# EAGLE board TAMDL_V2 (EAGLE 7.3.0)
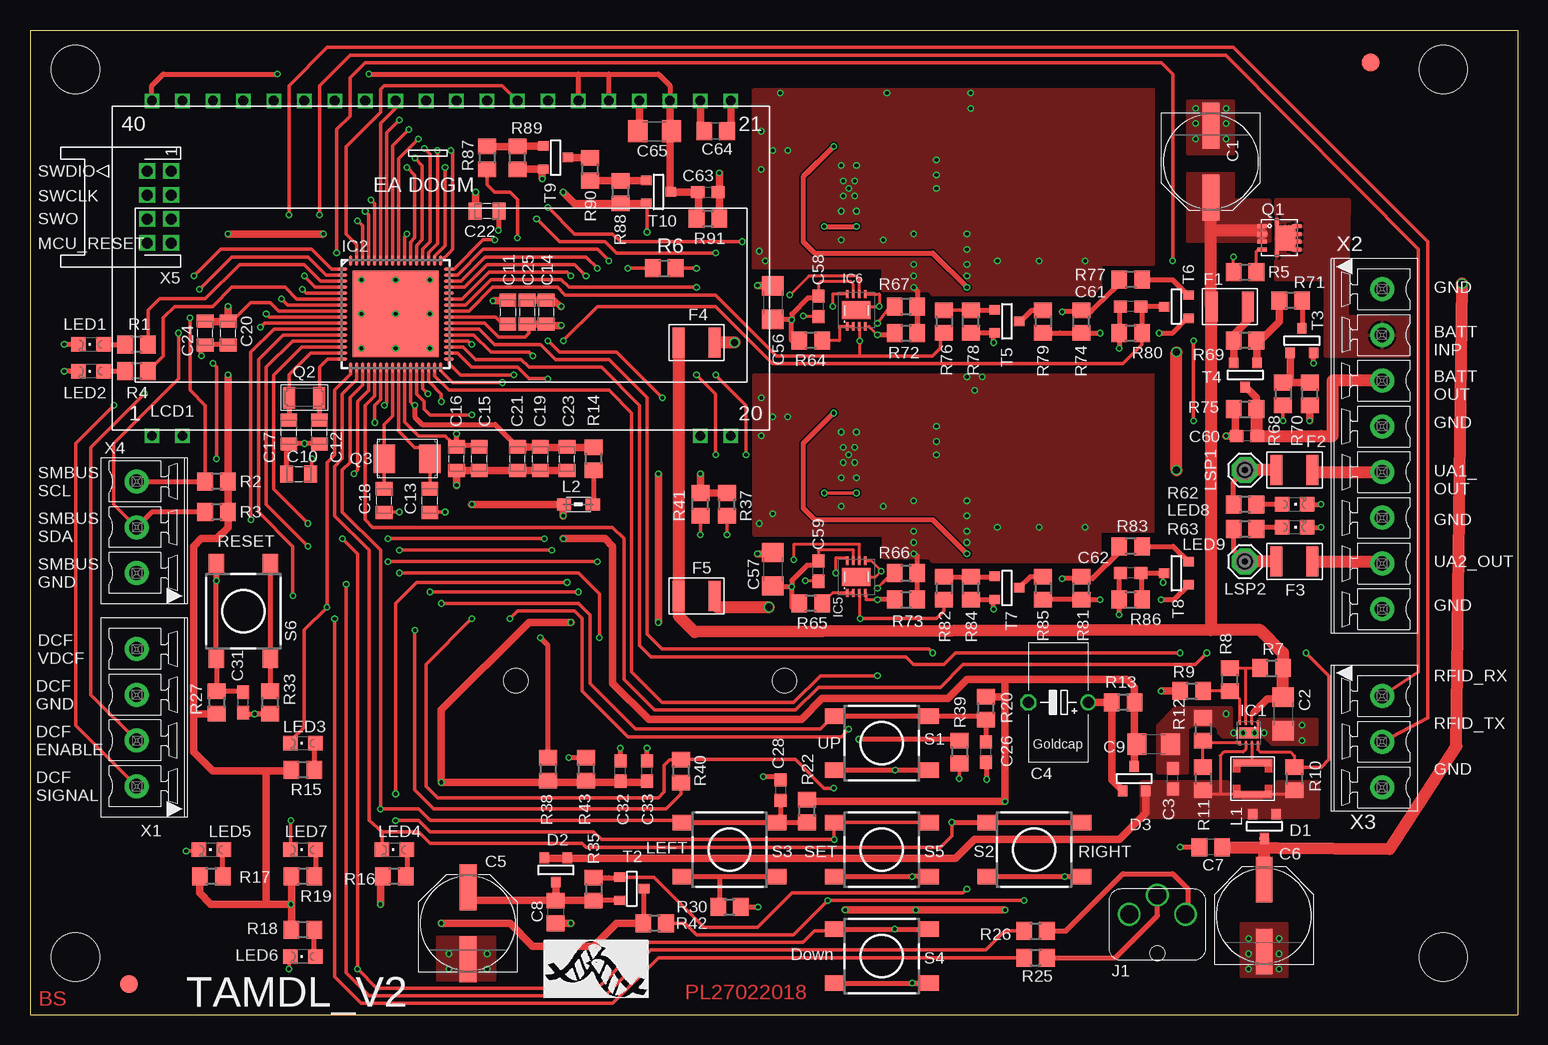
[diagram p6: board, top side]
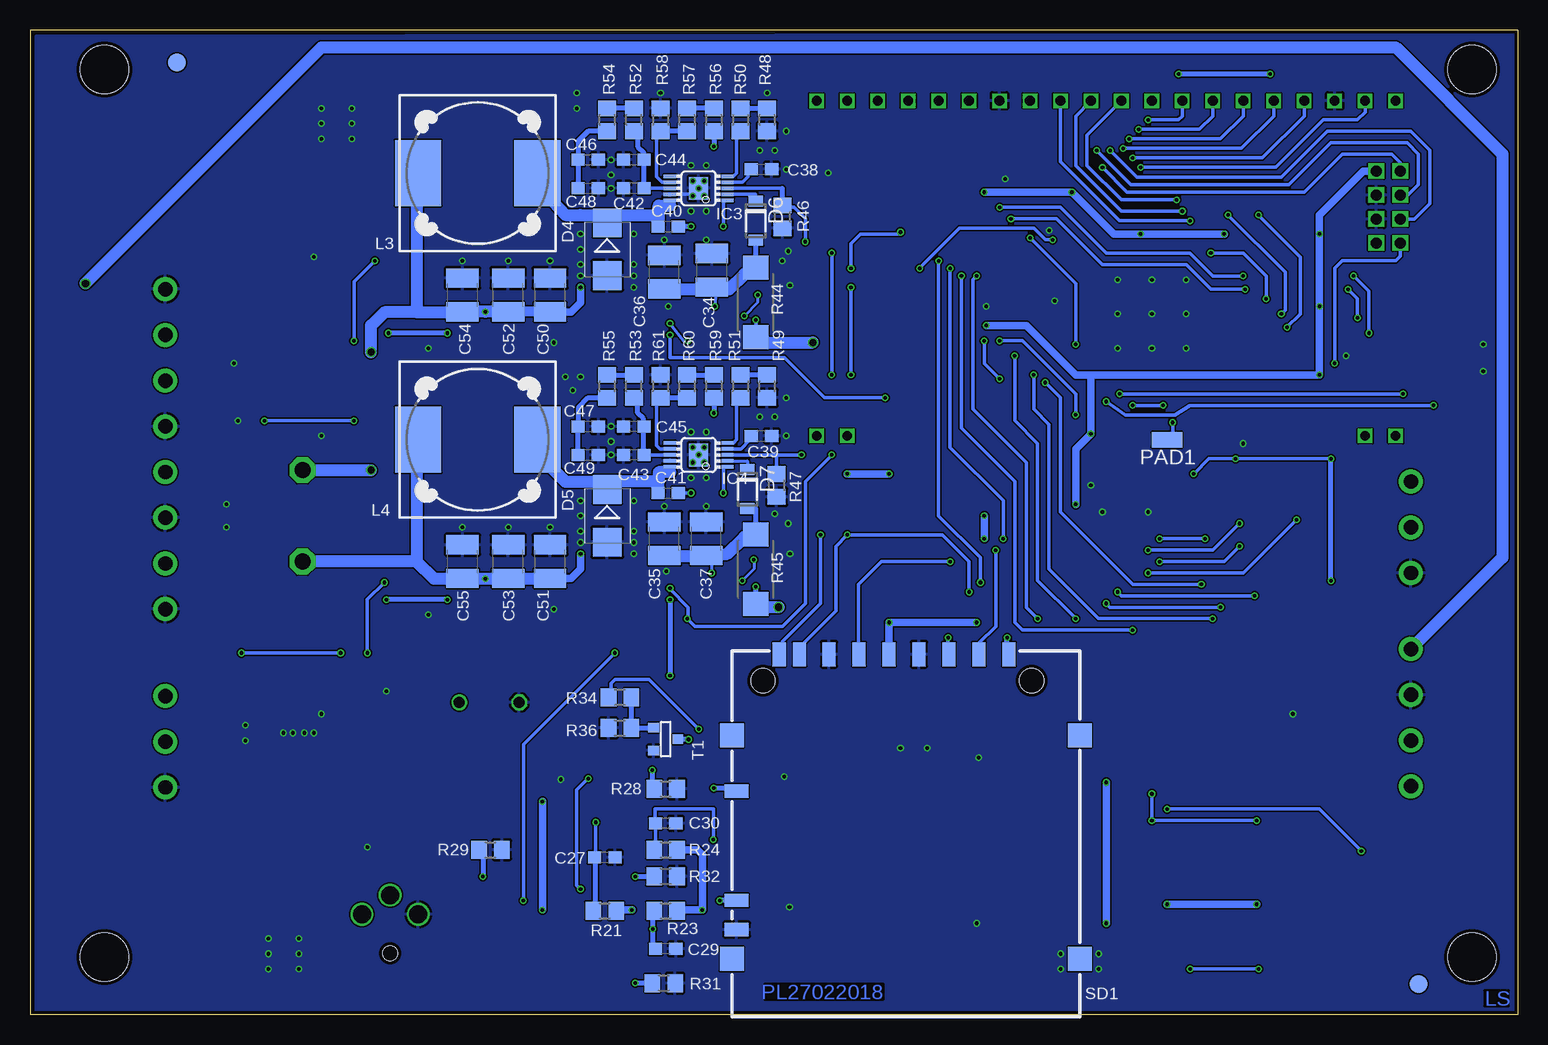
[diagram p7: board, bottom side, seen from below]

Size 124 x 82.1 mm. Coordinates in mm from the lower left corner, seen from the top.
Outline: 0,82.1 0,0 124,0 124,82.1 0,82.1
Copper layers (1*16): Top 0.035mm / dielectric 1.5mm / Bottom 0.035mm
Design rules "PCB-POOL HighSpec *": minimum track width 0.125mm, minimum drill 0.2mm, track to track 0.125mm, track to pad 0.125mm, pad to pad 0.125mm, via to via 0.125mm, smd to smd 0mil, copper to edge 0.3mm, drill to drill 0.2mm, minimum pad ring 0.2mm, minimum via ring 0.125mm, stop-mask expansion 0.075mm, vias tented up to drill 0mil, thermal gap 0.2mm
Net classes: 1 GND: width 0.2 mm; 2 VCC: width 0.25 mm
Holes 4 mm at 3.8,4.8 3.8,78.8 117.8,78.8 117.8,4.8

## Footprints (pad centres in the part's own frame; a part is rotated, then mirrored left to right if it is on the bottom)
PANASONIC_E = smd 3.8 x 1.4: + 3,0; - -3,0
C1206 = smd 1.6 x 1.8: 1 -1.4,0; 2 1.4,0
C0603 = smd 1.1 x 1: 1 -0.85,0; 2 0.85,0
GOLDCAPSPK-V = drill 0.9: + -2.5,0 | drill 0.9 octagon: - 2.5,0
C0805 = smd 1.3 x 1.5: 1 -0.95,0; 2 0.95,0
0805 = smd 1.092 x 1.397: 1 -0.991,0; 2 0.991,0
C1210 = smd 1.6 x 2.7: 1 -1.4,0; 2 1.4,0
SOT-23$1 = smd 0.787 x 0.889: 1 0.025,-1.016; 2 -0.94,1.016; 3 0.991,1.016
SMB = smd 2.4 x 2.4: A 2.2,0; C -2.2,0
SOD123FL = smd 0.91 x 1.22: A 1.625,0; C -1.625,0
PFUF_1210POLY = smd 1 x 2.5: P$1 -1.5,0; P$2 1.5,0
DSG_PWSO-N8_EXP = smd 0.2 x 0.4: 1 -0.75,-0.85; 2 -0.25,-0.85; 3 0.25,-0.85; 4 0.75,-0.85; 5 0.75,0.85; 6 0.25,0.85; 7 -0.25,0.85; 8 -0.75,0.85 | smd 1.6 x 0.9: EXP 0,0
QFN64 = smd 0.85 x 0.3: 1 -4.45,3.75; 2 -4.45,3.25; 3 -4.45,2.75; 4 -4.45,2.25; 5 -4.45,1.75; 6 -4.45,1.25; 7 -4.45,0.75; 8 -4.45,0.25; 9 -4.45,-0.25; 10 -4.45,-0.75; 11 -4.45,-1.25; 12 -4.45,-1.75; 13 -4.45,-2.25; 14 -4.45,-2.75; 15 -4.45,-3.25; 16 -4.45,-3.75; 33 4.45,-3.75; 34 4.45,-3.25; 35 4.45,-2.75; 36 4.45,-2.25; 37 4.45,-1.75; 38 4.45,-1.25; 39 4.45,-0.75; 40 4.45,-0.25; 41 4.45,0.25; 42 4.45,0.75; 43 4.45,1.25; 44 4.45,1.75; 45 4.45,2.25; 46 4.45,2.75; 47 4.45,3.25; 48 4.45,3.75 | smd 0.3 x 0.85: 17 -3.75,-4.45; 18 -3.25,-4.45; 19 -2.75,-4.45; 20 -2.25,-4.45; 21 -1.75,-4.45; 22 -1.25,-4.45; 23 -0.75,-4.45; 24 -0.25,-4.45; 25 0.25,-4.45; 26 0.75,-4.45; 27 1.25,-4.45; 28 1.75,-4.45; 29 2.25,-4.45; 30 2.75,-4.45; 31 3.25,-4.45; 32 3.75,-4.45; 49 3.75,4.45; 50 3.25,4.45; 51 2.75,4.45; 52 2.25,4.45; 53 1.75,4.45; 54 1.25,4.45; 55 0.75,4.45; 56 0.25,4.45; 57 -0.25,4.45; 58 -0.75,4.45; 59 -1.25,4.45; 60 -1.75,4.45; 61 -2.25,4.45; 62 -2.75,4.45; 63 -3.25,4.45; 64 -3.75,4.45 | smd 7.2 x 7.2: 65 0,0
S-PDSO-G10 = smd 0.3 x 1.02: 1 -1,-2.4; 2 -0.5,-2.4; 3 0,-2.4; 4 0.5,-2.4; 5 1,-2.4; 6 1,2.4; 7 0.5,2.4; 8 0,2.4; 9 -0.5,2.4; 10 -1,2.4 | smd 1.9 x 1.6: EXP 0,0
DFN8-LEAD = smd 0.2 x 0.7: 1 -0.75,-1.35; 2 -0.25,-1.35; 3 0.25,-1.35; 4 0.75,-1.35; 5 0.75,1.35; 6 0.25,1.35; 7 -0.25,1.35; 8 -0.75,1.35 | smd 2.38 x 1.5: EXP 0,0
LUMBERG1502_01 = drill 1.5: P$1 -2.35,0.75; P$2 0,2.35; P$3 2.35,0.75 | hole 1.2: 0,-2.5
LPS3008 = smd 0.63 x 3.3: 1 -1.335,0; 2 1.335,0
0805' = smd 1.2 x 1: 1 -1.2,0; 2 1.2,0
DR127 = smd 3.85 x 5.5: 1 -4.975,0; 2 4.975,0
EA_DOGM = drill 0.813 square: 1 0,0; 2 2.54,0; 19 45.72,0; 20 48.26,0; 21 48.26,27.94; 22 45.72,27.94; 23 43.18,27.94; 24 40.64,27.94; 25 38.1,27.94; 26 35.56,27.94; 27 33.02,27.94; 28 30.48,27.94; 29 27.94,27.94; 30 25.4,27.94; 31 22.86,27.94; 32 20.32,27.94; 33 17.78,27.94; 34 15.24,27.94; 35 12.7,27.94; 36 10.16,27.94; 37 7.62,27.94; 38 5.08,27.94; 39 2.54,27.94; 40 0,27.94
CHIPLED_0805 = smd 1.2 x 1.2: A 0,-1.05; C 0,1.05
SE13 = drill 1.321 pad 2.159 octagon: MP 0,0
SMD1,27-2,54 = smd 1.27 x 2.54: 1 0,0
ROUND2_1.5MM = smd 1.5 x 1.5: FID 0,0
TRANSISTOR-FET_1212-8S = smd 0.8 x 0.34: 1 -1.435,0.97; 2 -1.435,0.325; 3 -1.435,-0.325; 4 -1.435,-0.975; 5 1.435,-0.975; 6 1.435,-0.325; 7 1.435,0.325; 8 1.435,0.975 | smd 0.3 x 0.8: 9 -0.2,-1.225; 10 -0.2,1.25 | smd 1.7 x 2.1: 11 0.5,-0.015
CRYSTAL2P3.2X1.5 = smd 1 x 1.8: 1 -1.25,0; 2 1.25,0
CRYSTAL2P5.0X3.2 = smd 1.8 x 2.4: 1 -1.9,0; 2 1.9,0
R0805 = smd 1.3 x 1.5: 1 -0.95,0; 2 0.95,0
R2512W = smd 2 x 2.1: 1 -2.896,0; 2 2.896,0
DTSM-6 = smd 1.55 x 1.3: 1 -3.975,2.25; 2 3.975,2.25; 3 -3.975,-2.25; 4 3.975,-2.25
DM1AA-SF-PEJ = smd 1.1 x 2: 1 6.1,14.95; 2 3.6,14.95; 3 1.1,14.95; 4 -1.4,14.95; 5 -3.9,14.95; 6 -6.4,14.95; 7 -8.85,14.95; 8 -10.55,14.95; 9 8.6,14.95 | smd 2 x 1.1: CDS -14.1,3.55; COM -14.1,-8; WPS -14.1,-5.566 | smd 2 x 2: G1 -14.5,8.2; G2 -14.5,-10.45; G3 14.5,-10.45; G4 14.5,8.2 | hole 2: -11.9,12.75; 10.5,12.75
ZETEX_SOT-23 = smd 0.787 x 0.889: 1 0.025,-1.016; 2 -0.94,1.016; 3 0.991,1.016
1803439 = drill 1.2 pad 2: 1 -3.81,0.635; 2 0,0.635; 3 3.81,0.635
1803484 = drill 1.2 pad 2: 1 -13.335,-0.635; 2 -9.525,-0.635; 3 -5.715,-0.635; 4 -1.905,-0.635; 5 1.905,-0.635; 6 5.715,-0.635; 7 9.525,-0.635; 8 13.335,-0.635
1803442 = drill 1.2 pad 2: 1 -5.715,0.635; 2 -1.905,0.635; 3 1.905,0.635; 4 5.715,0.635
DP11_8DP-2DS = drill 0.9 square: 1 3,-9.2; 2 3,-7.2; 3 1,-9.2; 4 1,-7.2; 5 -1,-9.2; 6 -1,-7.2; 7 -3,-9.2; 8 -3,-7.2

## Placement (x,y rotation side)
C1  100µF/25V  [PANASONIC_E]  98.42,71.12 270 top
C2  10µF/25V  [C1206]  104.46,25.08 270 top
C3  22µF/10V  [C0603]  95.25,19.68 90 top
C4  EECS0HD 224;Panasonic  [GOLDCAPSPK-V]  85.72,26.04 180 top
C5  100µF/25V  [PANASONIC_E]  36.51,7.62 90 top
C6  100µF/25V  [PANASONIC_E]  102.87,8.26 90 top
C7  100nF/16V  [C0805]  98.42,13.97 180 top
C8  100nF/16V  [C0805]  43.81,8.57 270 top
C9  10µ/25V  [C1206]  93.66,22.54 180 top
C10  100n  [0805]  22.4,45.07 0 top
C11  1u  [0805]  39.83,58.58 270 top
C12  18p  [0805]  24.13,48.58 90 top
C13  12p  [0805]  33.34,42.86 90 top
C14  100n  [0805]  43.02,58.58 270 top
C15  100n  [0805]  37.47,46.35 90 top
C16  100n  [0805]  35.56,46.35 90 top
C17  18p  [0805]  21.59,48.58 90 top
C18  12p  [0805]  29.53,42.86 90 top
C19  10µ  [0805]  42.55,46.35 90 top
C20  100n  [0805]  16.51,56.83 90 top
C21  100n  [0805]  40.64,46.35 90 top
C22  100n  [0805]  38.1,66.99 180 top
C23  100n  [0805]  44.77,46.35 90 top
C24  100n  [0805]  14.61,56.83 90 top
C25  10µ  [0805]  41.43,58.58 270 top
C26  10nF  [C0603]  79.69,21.91 90 top
C27  10nF  [C0603]  76.09,13.11 180 bottom
C28  10nF  [C0603]  62.55,18.73 270 top
C29  10nF  [C0603]  71.01,5.49 180 bottom
C30  10nF  [C0603]  71.01,15.97 180 bottom
C31  10n  [C0603]  17.78,26.04 90 top
C32  100nF  [C0603]  49.21,20.32 90 top
C33  100nF  [C0603]  51.44,20.32 90 top
C34  4.7µF  [C1210]  67.15,62.07 90 bottom
C35  4.7µF  [C1210]  71.12,39.69 90 bottom
C36  n.b.  [C1210]  71.12,61.91 90 bottom
C37  n.b.  [C1210]  67.63,39.69 90 bottom
C38  10nF  [C0603]  63.02,70.49 0 bottom
C39  10nF  [C0603]  63.02,48.26 0 bottom
C40  100nF  [C0603]  70.8,65.72 0 bottom
C41  100nF  [C0603]  70.8,43.5 0 bottom
C42  n.b.  [C0603]  73.66,68.9 180 bottom
C43  n.b.  [C0603]  73.66,46.67 180 bottom
C44  4.3nF  [C0603]  73.66,71.28 180 bottom
C45  4.3nF  [C0603]  73.66,49.05 180 bottom
C46  24pF  [C0603]  77.47,71.28 0 bottom
C47  24pF  [C0603]  77.47,49.05 0 bottom
C48  n.b.  [C0603]  77.47,68.9 0 bottom
C49  n.b  [C0603]  77.47,46.67 0 bottom
C50  22µF  [C1210]  80.65,60.01 90 bottom
C51  22µF  [C1210]  80.65,37.78 90 bottom
C52  22µF  [C1210]  84.14,60.01 90 bottom
C53  22µF  [C1210]  84.14,37.78 90 bottom
C54  n.b.  [C1210]  87.95,60.01 90 bottom
C55  n.b.  [C1210]  87.95,37.78 90 bottom
C56  10µF  [C1206]  61.91,59.37 270 top
C57  10µF  [C1206]  61.91,37.15 270 top
C58  100nF  [C0603]  65.72,59.06 90 top
C59  100nF  [C0603]  65.72,36.99 90 top
C60  100nF  [C0603]  101.44,48.26 180 top
C61  1nF  [C0603]  91.76,59.05 180 top
C62  1nF  [C0603]  91.76,36.83 180 top
C63  100nF  [C0603]  56.52,68.58 0 top
C64  470n  [C0805]  57.15,73.66 180 top
C65  100n  [C1206]  52.07,73.66 0 top
D1  BAT54C  [SOT-23$1]  102.87,15.72 0 top
D2  BAT54C  [SOT-23$1]  43.81,12.06 0 top
D3  BAT54C  [SOT-23$1]  92.08,19.68 180 top
D4  B360B  [SMB]  75.88,63.82 270 bottom
D5  B360B  [SMB]  75.88,41.59 270 bottom
D6  MBR2H200SFT1G  [SOD123FL]  63.5,66.2 270 bottom
D7  MBR2H200SFT1G  [SOD123FL]  64.2,43.81 270 bottom
F1  MF-USMF110  [PFUF_1210POLY]  100.01,59.05 180 top
F2  MF-USMF110  [PFUF_1210POLY]  105.41,45.4 0 top
F3  MF-USMF110  [PFUF_1210POLY]  105.41,37.78 0 top
F4  MF-USMF150  [PFUF_1210POLY]  55.56,56.04 0 top
F5  MF-USMF150  [PFUF_1210POLY]  55.56,34.92 0 top
IC1  TPS62125  [DSG_PWSO-N8_EXP]  101.6,23.5 180 top
IC2  EFM32G230F128  [QFN64]  30.48,58.42 0 top
IC3  TPS54240DGQR  [S-PDSO-G10]  68.26,68.9 90 bottom
IC4  TPS54240DGQR  [S-PDSO-G10]  68.26,46.67 90 bottom
IC5  LTC6102IDD-1  [DFN8-LEAD]  68.89,36.51 0 top
IC6  LTC6102IDD-1  [DFN8-LEAD]  68.89,58.73 0 top
J1  LUMBERG1502_01  [LUMBERG1502_01]  93.98,7.62 0 top
L1  LPS3008/22µH  [LPS3008]  101.92,19.68 270 top
L2  BLM21B102S  [0805']  45.72,42.55 0 top
L3  PIS4728  [DR127]  86.68,70.17 180 bottom
L4  PIS4728  [DR127]  86.68,47.94 180 bottom
LCD1  Buchsenleisten(Conrad 741360) (n.b.)EA_DOGM162L_A  [EA_DOGM]  10.16,48.26 0 top
LED1  SML-H12U8TT86  [CHIPLED_0805]  5.08,55.88 90 top
LED2  SML-H12Y8TT86  [CHIPLED_0805]  5.08,53.66 90 top
LED3  SML-H12Y8TT86  [CHIPLED_0805]  22.75,22.64 90 top
LED4  SML-H12Y8TT86  [CHIPLED_0805]  30.37,13.75 90 top
LED5  SML-H12Y8TT86  [CHIPLED_0805]  15.13,13.75 90 top
LED6  SML-H12Y8TT86  [CHIPLED_0805]  22.75,4.86 90 top
LED7  SML-H12U8TT86  [CHIPLED_0805]  22.75,13.75 90 top
LED8  (n.b.)  [CHIPLED_0805]  105.41,42.55 270 top
LED9  (n.b.)  [CHIPLED_0805]  105.41,40.64 270 top
LSP1  (n.b.)SE13  [SE13]  101.28,45.4 0 top
LSP2  (n.b.)SE13  [SE13]  101.28,37.78 0 top
PAD1  (n.b.)  [SMD1,27-2,54]  29.21,47.94 90 bottom
PASS1  ROUND_1MM1.5  [ROUND2_1.5MM]  8.26,2.54 0 top
PASS2  ROUND_1MM1.5  [ROUND2_1.5MM]  8.26,2.54 0 bottom
PASS3  ROUND_1MM1.5  [ROUND2_1.5MM]  111.76,79.38 0 top
PASS4  ROUND_1MM1.5  [ROUND2_1.5MM]  111.76,79.38 0 bottom
Q1  SI7121DN  [TRANSISTOR-FET_1212-8S]  104.14,64.77 0 top
Q2  CM7V, 32768Hz/12.5pF  [CRYSTAL2P3.2X1.5]  22.86,51.44 180 top
Q3  NX5032GA/32MHz/8pF  [CRYSTAL2P5.0X3.2]  31.43,46.35 180 top
R1  1K2  [R0805]  8.89,55.88 180 top
R2  1k  [R0805]  15.56,44.45 180 top
R3  1k  [R0805]  15.56,41.91 180 top
R4  1K2  [R0805]  8.89,53.66 180 top
R5  100k  [R0805]  101.28,61.91 0 top
R6  100K  [R0805]  52.86,62.23 0 top
R7  1M47  [R0805]  103.5,28.89 0 top
R8  200K  [R0805]  100.01,27.94 90 top
R9  30K9  [R0805]  96.84,26.99 0 top
R10  100K  [R0805]  105.41,19.68 90 top
R11  2M  [R0805]  97.79,19.68 270 top
R12  560K  [R0805]  97.79,23.81 270 top
R13  100  [R0805]  91.12,26.04 180 top
R14  1  [R0805]  46.99,46.35 90 top
R15  1K  [R0805]  22.75,20.42 180 top
R16  1K  [R0805]  30.37,11.53 180 top
R17  1K  [R0805]  15.13,11.53 180 top
R18  1K  [R0805]  22.75,7.08 180 top
R19  1K  [R0805]  22.75,11.53 180 top
R20  100K  [R0805]  79.69,25.56 90 top
R21  100K  [R0805]  76.09,8.67 0 bottom
R22  100K  [R0805]  64.77,16.99 90 top
R23  100K  [R0805]  71.01,8.67 0 bottom
R24  100K  [R0805]  71.01,13.75 0 bottom
R25  10K  [R0805]  83.82,4.76 0 top
R26  10K  [R0805]  83.82,6.99 0 top
R27  100K  [R0805]  15.56,26.04 270 top
R28  100  [R0805]  71.01,18.83 0 bottom
R29  100  [R0805]  85.62,13.75 0 bottom
R30  100  [R0805]  58.31,8.99 0 top
R31  100  [R0805]  71.17,2.64 0 bottom
R32  100  [R0805]  71.01,11.53 0 bottom
R33  100  [R0805]  20,26.04 270 top
R34  100  [R0805]  74.82,26.45 180 bottom
R35  100K  [R0805]  46.99,10.48 270 top
R36  100K  [R0805]  74.82,23.91 0 bottom
R37  10K  [R0805]  58.1,42.55 90 top
R38  10K  [R0805]  43.18,20.48 270 top
R39  100  [R0805]  77.47,21.91 270 top
R40  1K  [R0805]  54.29,20.3 90 top
R41  1K  [R0805]  55.88,42.55 90 top
R42  (n.b.)10K  [R0805]  52.07,7.62 180 top
R43  100K  [R0805]  46.35,20.48 270 top
R44  0.006  [R2512W]  63.5,59.37 90 bottom
R45  0.006  [R2512W]  63.5,37.15 90 bottom
R46  100K  [R0805]  61.28,66.52 90 bottom
R47  100K  [R0805]  61.75,44.13 90 bottom
R48  348K  [R0805]  62.55,74.61 90 bottom
R49  348K  [R0805]  62.55,52.39 90 bottom
R50  0R  [R0805]  64.77,74.61 270 bottom
R51  0R  [R0805]  64.77,52.39 270 bottom
R52  39K  [R0805]  73.66,74.61 90 bottom
R53  39K  [R0805]  73.66,52.39 90 bottom
R54  0R  [R0805]  75.88,74.61 90 bottom
R55  0R  [R0805]  75.88,52.39 90 bottom
R56  0R  [R0805]  66.99,74.61 270 bottom
R57  105K  [R0805]  69.22,74.61 90 bottom
R58  10k  [R0805]  71.44,74.61 270 bottom
R59  0R  [R0805]  66.99,52.39 270 bottom
R60  53K  [R0805]  69.22,52.39 90 bottom
R61  10K  [R0805]  71.44,52.39 270 bottom
R62  (n.b.)  [R0805]  101.28,42.55 180 top
R63  (n.b.)  [R0805]  101.28,40.48 180 top
R64  150  [R0805]  65.09,56.2 180 top
R65  150  [R0805]  65.09,34.29 180 top
R66  100K  [R0805]  73.02,36.83 0 top
R67  100K  [R0805]  73.02,59.06 0 top
R68  100  [R0805]  104.46,51.75 270 top
R69  100K  [R0805]  101.28,56.2 180 top
R70  100K  [R0805]  106.68,51.75 90 top
R71  100  [R0805]  105.09,59.53 180 top
R72  40K  [R0805]  73.02,56.83 0 top
R73  40K  [R0805]  73.02,34.61 0 top
R74  100K  [R0805]  87.63,57.78 90 top
R75  100K  [R0805]  101.28,50.48 0 top
R76  100  [R0805]  76.2,57.78 270 top
R77  300K  [R0805]  91.76,61.28 180 top
R78  100K  [R0805]  78.42,57.78 90 top
R79  100  [R0805]  84.45,57.79 270 top
R80  100K  [R0805]  91.76,56.83 0 top
R81  100K  [R0805]  87.63,35.56 90 top
R82  100  [R0805]  76.2,35.56 270 top
R83  300K  [R0805]  91.76,39.05 180 top
R84  100K  [R0805]  78.42,35.56 90 top
R85  100  [R0805]  84.45,35.56 270 top
R86  100K  [R0805]  91.76,34.61 0 top
R87  100  [R0805]  38.1,71.44 270 top
R88  100K  [R0805]  49.21,68.58 270 top
R89  100K  [R0805]  40.64,71.44 90 top
R90  100  [R0805]  46.67,70.48 270 top
R91  100K  [R0805]  56.52,66.36 180 top
S1  SWPB_B3S1000  [DTSM-6]  71.01,22.66 0 top
S2  SWPB_B3S1000  [DTSM-6]  83.71,13.77 0 top
S3  SWPB_B3S1000  [DTSM-6]  58.31,13.77 0 top
S4  SWPB_B3S1000  [DTSM-6]  71.01,4.88 0 top
S5  SWPB_B3S1000  [DTSM-6]  71.01,13.77 0 top
S6  SWPB_B3S1000  [DTSM-6]  17.78,33.66 90 top
SD1  DM1AA-SF-PEJ  [DM1AA-SF-PEJ]  51,15.1 0 bottom
T1  2N7002  [ZETEX_SOT-23]  71.01,22.96 90 bottom
T2  FDN358P  [ZETEX_SOT-23]  50.16,10.48 90 top
T3  2N7002  [ZETEX_SOT-23]  106.05,56.2 180 top
T4  FDN358P  [ZETEX_SOT-23]  101.28,53.34 0 top
T5  2N7002  [ZETEX_SOT-23]  81.44,57.78 90 top
T6  FDN358P  [ZETEX_SOT-23]  95.57,59.05 270 top
T7  2N7002  [ZETEX_SOT-23]  81.44,35.56 90 top
T8  FDN358P  [ZETEX_SOT-23]  95.57,36.83 270 top
T9  2N7002  [ZETEX_SOT-23]  43.81,71.44 90 top
T10  FDN358P  [ZETEX_SOT-23]  52.39,68.58 90 top
U$1  [MPIO-ICON]  42.86,1.43 0 top
X1  1803439  [1803439]  9.53,40.64 90 top
X2  1803484  [1803484]  113.35,47.15 270 top
X3  1803439  [1803439]  112.08,22.77 270 top
X4  1803442  [1803442]  9.53,24.77 90 top
X5  DF11_8DP_2DS  [DP11_8DP-2DS]  2.57,67.34 90 top

## Tracks (layer width: path | path; a pad name or v marks a point on that pad's centre or on a via)
1
  Top 0.254: IC1.6 101.35,22.13 101.12,21.91 99.54,21.91 99.22,21.59 99.22,18.41 | 99.22,18.41 101.85,18.41 L1.2 102.96,18.35 103.03,18.41 105.09,18.41 R10.1 | R11.2 97.79,18.41 99.22,18.41
  Top 0.61: D3.2 93.03,18.66 93.03,16.83 90.81,14.61 78.74,14.61 77.15,13.02 44.77,13.02 | 44.77,13.02 42.94,13.02 D2.2 | D2.3 44.81,13.06 44.77,13.02
  pour Top (no thermals): 92.71,19.37 99.85,19.37 99.85,18.41 103.98,18.41 103.98,19.37 107.31,19.37 107.31,16.51 92.71,16.51
AVDD  (via drill 0.3)
  Top 0.305: IC2.23 29.73,51 v29.53,50.8 | v32.07,50.8 31.73,51.1 IC2.27
  Top 0.406: v32.07,50.8 32.07,49.85 32.7,49.21 38.77,49.21 C21.2 | C19.2 C23.2
  Top 0.61: R14.2 42.59,47.3 C19.2 C21.2
  Bottom 0.305: v29.53,50.8 v32.07,50.8
BAT+
  pour Top: 107.95,54.93 114.94,54.93 114.94,58.1 109.86,58.26 110.01,67.94 103.82,67.94 103.82,61.28 107.95,61.28
BATT_INPUT
  Top 0.254: IC1.2 101.85,25.17 102.08,25.24
  Top 0.61: 102.08,25.24 103.16,26.32 104.46,26.32 C2.1
  Top 1.016: C2.1 R7.2 | 98.42,32.07 102.55,32.07 104.46,30.16 R7.2 | 98.42,65.41 102.39,65.41 Q1.2 | 98.42,59.14 98.42,32.07 | 98.42,32.07 55.4,31.91 54.06,33.25 F5.P$1 F4.P$1 | R7.2 | F1.P$2 98.42,59.14 | 98.42,59.14 98.42,65.41 | 98.42,65.41 C1.+
  pour Top (no thermals): 103.35,64.45 96.52,64.45 96.52,70.17 100.33,70.17 100.33,67.94 103.35,67.94
BATT_OUTPUT
  Top 0.61: T4.1 101.35,52.32 102.23,51.44 R75.2
  Top 1.016: C60.1 107.63,48.26 | C60.1 102.29,50.42 R75.2 | C60.1 108.58,48.26 108.58,52.7 108.58,52.86 X2.3
BATT_UE
  Top 0.61: F1.P$1 101.51,57.86 100.33,56.67 R69.2 100.34,56.19 T4.2
GND  (via drill 0.3)
  Top 0.254: R5.1 100.33,61.6 v100.33,63.18 | IC1.1 102.35,23.61 v102.08,23.5 | IC6.5 70.8,60.08 v70.8,59.05 69.37,59.05 IC6.EXP | IC5.5 70.09,37.86 v70.96,36.99 70.48,36.51 IC5.EXP
  Top 0.305: v107,54.29 | C12.1 24.13,47.62 23.81,47.62 | v30.8,41.91 29.53,41.91 C18.1 | v34.61,41.91 33.34,41.91 C13.1 | v35.56,44.13 | IC2.65 | IC2.65 | v22.86,47.62
  Top 0.406: R43.1 v44.93,21.43 | C32.2 v49.21,22.23 | C33.2 v51.44,22.23 | 73.98,38.26 73.98,36.2 R66.2 R73.2 | R84.1 78.42,34.45 R84.1 78.9,34.61 78.91,34.62 T7.2 80.33,34.62 v80.33,33.81 | C26.1 79.74,20.58 v79.74,19.62 | C28.1 62.55,19.84 v61.12,19.84 | R30.2 v60.69,8.99 | v73.66,60.64 73.98,60.33 73.98,58.42 | 73.98,58.9 73.98,58.42 | 73.98,58.42 R72.2 R67.2 | 80.33,56.83 80.33,56.2 v80.33,56.04 80.33,56.83 | 80.33,56.83 80.09,56.83 T5.2 | 80.33,56.83 79.06,56.83 78.74,56.83 R78.1 | 61.78,38.42 C57.1 | C61.2 | C61.2 90.81,59.05 R80.1 v90.81,55.56 | v90.81,33.34 R86.1 90.81,36.73 C62.2 | LED8.C v107.63,42.55 | LED9.C v107.63,40.64 | v107,54.29 107,54.7 T3.2 | C22.1 38.89,66.99 39.05,66.99 v39.05,65.41 | 3.49,53.66 LED2.C 3.4,53.66 v2.86,53.66 | 4.19,55.88 LED1.C 3.71,55.88 v2.86,55.88 | v22.86,47.62 | v22.86,47.62 22.54,47.62 21.59,47.62 C17.1 21.41,47.57 C10.1 | v14.29,54.93 14.29,55.88 | 14.29,55.88 | 14.29,55.88 14.61,55.88 | 14.61,55.88 C24.1 14.61,55.88 | 23.81,47.62 v22.86,47.62 | C31.1 17.78,25.08 17.78,25.09 R33.2 v18.73,25.08 | C7.2 96.52,13.97 v95.89,13.97 | C11.1 39.88,59.57 39.85,59.53 | 38.73,59.53 v38.58,59.53 | 43.02,59.53 C14.1 | C20.1 16.47,55.88 14.61,55.88 | 14.61,55.88
  Top 0.61: LED8.C 106.42,42.59 | v60.64,60.8 61.12,60.8 | 61.12,60.8 | 61.12,60.8 62.07,60.8 C56.1 | v60.64,38.42 61.78,38.42 | R9.1 v94.3,26.99 | v99.69,48.26 99.85,48.26 C60.2 100.49,48.36 100.49,50.48 R75.1 | v106.68,49.53 R70.1 | R70.1 | 57.47,66.83 57.47,68.58 C63.2 | R91.1 57.47,66.83 | 57.47,66.83 v57.47,70.17 | 42.72,70.5 40.8,70.5 R89.1 | v42.7,69.69 42.7,70.48 42.72,70.5 | 42.72,70.5 T9.2 | v35.56,44.13 C16.1 C15.1 C21.1 C19.1 C23.1 | C8.2 v45.09,7.62 | C25.1 C14.1 | v44.29,59.05 43.66,59.53 43.02,59.53 | 39.85,59.53 38.73,59.53
  Bottom 0.305: IC3.9 68.87,68.4 v68.74,68.26 | 68.87,46.17 v68.74,46.04
  other vias: 67.79,69.53 67.79,68.26 68.74,69.53 68.26,68.9 68.26,46.67 67.79,46.04 67.79,47.31 68.74,47.31 62.55,76.84 84.14,40.64 78.42,75.56 78.42,76.83 71.44,76.83 63.18,72.07 61.91,72.07 73.66,61.59 68.9,70.8 67.63,70.8 68.9,66.99 71.12,64.61 73.66,65.09 75.56,71.28 75.56,68.9 78.1,61.59 78.1,63.82 75.56,70.01 73.66,62.55 67.63,64.61 61.28,62.86 63.18,49.85 61.91,41.75 67.63,42.39 80.64,40.64 87.95,40.64 73.66,42.86 75.56,49.05 75.56,46.67 78.1,53.18 78.74,52.07 79.37,53.18 60.96,51.43 78.1,40.32 78.1,41.59 78.1,42.86 67.63,66.99 80.64,62.86 84.14,62.86 87.95,62.86 78.1,65.09 61.91,49.85 68.9,48.58 67.63,48.58 68.9,44.77 67.63,44.77 75.56,47.78 73.66,40.32 73.66,39.37 78.1,39.37 71.12,42.39 78.1,62.55 73.66,38.42 97.15,75.56 97.15,74.29 97.15,73.02 99.69,73.02 99.69,74.29 99.69,75.56 101.12,23.49 106.04,24.13 106.04,22.86 99.69,25.08 100.33,23.49 102.87,23.49 101.6,6.35 101.6,5.08 101.6,3.81 104.14,3.81 104.14,5.08 104.14,6.35 38.1,3.81 38.1,5.08 34.92,5.08 34.92,3.81 30.48,58.42 27.62,61.28 30.48,61.28 33.34,61.28 27.62,58.42 33.34,58.42 33.34,55.56 30.48,55.56 27.62,55.56 60.96,48.26 60.8,40.96 60.8,63.66 60.96,70.48 60.96,73.66
  pour Bottom (rank 2): 0.32,0.32 0.32,81.76 123.51,81.6 123.51,0.32
  pour Top: 88.58,60.01 75.25,60.01 74.93,60.33 71.12,60.33 71.12,62.23 60.32,62.23 60.33,77.15 93.66,77.15 93.66,63.82 93.66,62.55 89.22,62.55 89.22,60.64
  pour Top: 93.66,53.34 60.32,53.34 60.32,40.01 71.12,40.01 71.12,40.01 71.12,38.1 74.93,38.1 75.25,37.78 88.58,37.78 89.22,38.42 89.22,40.32 93.66,40.32
  pour Top (no thermals): 96.52,76.2 100.33,76.2 100.33,71.75 96.52,71.75
  pour Top (no thermals): 107.31,24.61 102.39,24.61 102.39,23.65 100.33,23.65 100.17,23.97 100.17,25.56 95.41,25.56 93.98,24.13 93.98,20.16 96.52,20.16 96.52,23.81 96.84,24.13 98.74,24.13 99.06,23.81 99.06,23.5 99.38,23.18 102.87,23.18 103.5,22.54 107.31,22.54
  pour Top (no thermals): 100.97,7.62 104.78,7.62 104.78,3.17 100.97,3.17
  pour Top (no thermals): 33.97,2.86 33.97,6.51 38.73,6.51 38.73,2.86
IC4_IA1_+IN  (via drill 0.3)
  Top 0.254: IC6.8 66.91,60.08 v66.91,59.05
  Bottom 0.254: 67.79,60.3 67.12,60.3 66.99,60.17 66.83,60.17 v66.91,59.05
  Bottom 0.406: D6.A R44.2
  Bottom 0.61: C36.1 71.75,60.61 71.6,60.48 | 67.79,60.48 C34.1 67.79,60.3 68.58,60.33 | 63.66,62.23 R44.2 63.34,62.23 63.98,62.23
  Bottom 1.016: 71.6,60.48 68.1,60.48 | 67.79,60.48 68.1,60.48 | 68.1,60.48 67.63,60.48 65.72,60.48 64.45,61.75 63.98,62.23
IC4_IA1_-IN  (via drill 0.3, 0.6)
  Top 0.254: IC6.7 68.64,60.9 68.42,61.12 65.88,61.12 65.72,60.96 C58.2 | C58.2
  Top 0.406: v63.5,57.94 62.07,57.94 C56.2 | R64.2 63.5,56.2 v63.5,57.94 | C58.2 | C58.2 65.72,59.75 64.83,59.75 63.5,58.42 v63.5,57.94 | v63.5,57.94
  Top 1.016: v58.74,56.04 58.67,56.04 F4.P$2
  Bottom 0.305: 63.5,56.83 v63.5,57.94
  Bottom 0.406: R44.1 63.5,56.83
  Bottom 0.61: 63.66,56.04 R44.1
  Bottom 1.016: 63.66,56.04 v58.74,56.04
IC5_IA2_+IN  (via drill 0.3)
  Top 0.254: IC5.8 68.14,38.04 68.1,38.08 67.15,38.08 v67.15,36.83
  Bottom 0.254: v67.15,36.83 67.15,37.81 C37.1
  Bottom 0.305: R45.2 63.59,40.36
  Bottom 0.406: 67.79,37.82 68.3,37.82 68.42,37.94 C37.1 | D7.A 63.5,42.19 R45.2
  Bottom 0.61: R45.2 64.45,40.04 | C35.1 71.28,38.26 | 71.28,38.26 | 67.83,38.26 67.79,37.82 67.79,38.26 | 63.31,40.16 63.59,40.36
  Bottom 1.016: 71.28,38.26 67.83,38.26 | 67.79,38.26 65.88,38.42 64.45,39.85 63.31,40.16
IC5_IA2_-IN  (via drill 0.3, 0.6)
  Top 0.254: IC5.7 68.65,38.73 65.72,38.73 C59.2
  Top 0.406: C59.2 65.72,37.47 64.77,37.47 63.5,36.2 v63.5,35.68 | R65.2 63.5,33.97 v63.5,35.68 | v63.5,35.68 61.91,35.68 C57.2 | v63.5,35.68
  Top 1.016: v61.59,33.97 57.31,33.97 57.06,34.22 F5.P$2
  Bottom 0.406: v63.5,35.68 R45.1
  Bottom 0.61: 63.98,33.97 R45.1
  Bottom 1.016: v61.59,33.97 63.98,33.97
LCD_+3.3V  (via drill 0.3)
  Top 0.406: LCD1.40 10.16,77.47 11.11,78.42 v20.64,78.42 | v28.26,78.42 45.72,78.42 | LCD1.26 45.72,78.42 | 45.72,78.42 48.26,78.42 | LCD1.25 48.26,78.42 | 48.26,78.42 52.39,78.42 53.34,77.47 LCD1.23
  Top 0.61: C65.2 53.34,73.85 | 53.34,73.85 53.34,68.67 T10.1 53.43,68.58 C63.1 55.72,68.58 55.72,66.36 R91.2 | 53.34,73.85 LCD1.23
  Bottom 0.406: v20.64,78.42 v28.26,78.42
MCU_RESET  (via drill 0.3)
  Top 0.305: IC2.20 28.23,52.04 27.3,51.12 27.3,45.4 v26.99,45.09 | v15.56,46.35 15.56,53.98 v15.24,54.29 | v23.5,46.35 23.5,45.18 C10.2
  Top 0.406: C31.2 17.78,26.99 R27.1 15.56,29.65 S6.1 S6.2 15.56,37.62 v15.56,36.2
  Bottom 0.305: v26.99,45.09 25.72,46.35 v23.5,46.35 v15.56,46.35 | v15.24,54.29 15.24,62.23 14.61,62.87 10.16,62.87 9.77,63.25 X5.8
  Bottom 0.406: v15.56,36.2 v15.56,46.35
N$1
  Top 0.406: S6.4 S6.3 20,29.68 R33.1
N$2  (via drill 0.3)
  Top 0.406: v66.2,65.72 v68.9,65.72
  Bottom 0.305: IC3.1 66.2,67.9 66.2,65.88 66.18,65.9 v66.2,65.72 | C40.2
  Bottom 0.406: v68.9,65.72 C40.2
N$3
  Top 0.406: LED1.A R1.2
N$4
  Top 0.61: D3.3 90.17,19.58 R13.2 C4.+
N$5
  Top 0.406: LED2.A R4.2
N$6
  Top 0.254: IC1.3 101.35,28.89 | 101.35,28.89 R8.2 | R7.1 101.35,28.89
N$7
  Bottom 0.305: IC3.10 70.8,67.9 70.64,67.47
  Bottom 0.61: 76.36,66.65 D4.C 76.5,66.65 76.2,66.67 | 71.6,65.94 C40.1 | 80.96,68.42 82.23,70.17 L3.1
  Bottom 1.016: 80.96,68.42 79.38,66.67 78.11,66.67 76.36,66.65 | 76.2,66.67 71.6,66.67 | 71.6,66.67 71.6,67.47 70.64,67.47 | 71.6,66.67 71.6,65.94
N$8
  Top 0.254: IC1.4 100.85,26.31 100.65,26.51 100.49,26.51 R8.1 R9.2
N$9
  Top 0.254: IC1.7 101.85,20.93 L1.1
N$10
  Top 0.254: IC1.5 98.33,22.64 R12.2 R11.1
N$11
  Top 0.61: T4.3 102.27,56.16 R69.1 102.55,56.2 104.14,57.78 R71.2
N$12  (via drill 0.3)
  Top 0.406: R38.1 43.18,30.8 v42.55,31.43
  Bottom 0.406: SD1.9 42.39,29.84 42.39,30.66 42.56,30.65 v42.55,31.43
N$13  (via drill 0.3)
  Top 0.305: R37.1 v58.1,40.01
  Bottom 0.305: v58.1,40.01 58.1,34.29 61.28,31.11 61.28,30.8 61.59,30.8 61.59,30.09 SD1.8
  Bottom 0.406: SD1.8 61.38,30.05 61.48,30.1
N$14
  Top 0.406: R14.1 46.99,42.55 L2.2
N$15
  Bottom 0.305: IC3.4 64.59,69.4 64.14,69.85 | 64.14,69.85 | 64.14,69.85 64.14,70.64 64.03,70.64 C38.1
N$16
  Bottom 0.305: R52.1 73.98,73.66 73.34,73.66 | IC3.8 C42.1 72.87,68.9 73.18,68.9 72.87,69.06 | C44.1 72.87,71.28
  Bottom 0.406: 73.34,73.66 73.34,72.39 72.87,71.91 72.87,71.28 72.87,69.06 72.87,68.9
N$17
  Top 0.406: R71.1 106.04,57.53 T3.1
N$18
  Top 0.61: T3.3 105.05,52.7 | R68.1 105.05,52.7 | 105.05,52.7 R70.2
N$19  (via drill 0.3)
  Top 0.406: R79.2 85.88,56.84 R74.1 87.31,56.84 v89.22,56.83 | v94.14,56.83 95.25,56.83 96.48,58.06 T6.3
  Bottom 0.406: v89.22,56.83 v94.14,56.83
N$20
  Top 0.254: R5.2 102.23,61.59 102.23,63.66 102.37,63.8 Q1.4
N$21  (via drill 0.3)
  Top 0.305: IC2.22 29.21,53.97 29.21,51.28 28.73,50.8 v28.73,49.37
  Bottom 0.305: v28.73,49.37 28.73,48.42 PAD1.1
N$22
  Top 0.305: LED3.A 23.7,22.64 | 23.7,22.64 | 23.7,20.47 R15.1
  Top 0.406: 23.7,22.64 23.7,20.47
N$23  (via drill 0.3)
  Top 0.406: 75,20.42 S1.4 v72.12,20.41 S1.3
  Bottom 0.406: R28.1 72.12,18.99 v72.11,20.41 v72.11,20.42 v72.12,20.41
N$24  (via drill 0.3)
  Top 0.305: S2.4 86.26,11.52 v86.25,11.53
  Top 0.406: S2.3 S2.4
  Bottom 0.305: R29.1 86.25,13.75 | 86.25,13.75 | v86.25,11.53
  Bottom 0.406: 86.25,13.75 v86.25,11.53
N$25
  Top 0.254: IC6.2 IC6.1 67.47,57.38 67.47,56.2 R64.1 | R64.1
N$26
  Top 0.406: S3.3 57.52,11.52 | 57.52,11.52 S3.4 | R30.1 57.52,8.99 57.52,11.52
N$27  (via drill 0.3)
  Top 0.406: S4.3 S4.4 75.13,2.63 v73.55,2.64
  Bottom 0.305: v73.55,2.64
  Bottom 0.406: R31.1 v73.55,2.64
N$28  (via drill 0.3)
  Top 0.305: S5.3 67.19,11.52 67.2,11.53 | S5.4 74.83,11.52 74.82,11.53
  Top 0.406: 67.2,11.53 v73.55,11.53 74.82,11.53
  Bottom 0.305: 71.86,11.53 R32.1
  Bottom 0.406: v73.55,11.53 71.86,11.53
N$29
  Top 0.305: 31.42,11.73 R16.1
  Top 0.406: LED4.A 31.42,11.73
N$30
  Top 0.305: IC2.40 38.8,58.17 39.51,57.47 40.01,57.47 C11.2
N$31
  Top 0.61: T10.3 51.37,69.53 R88.1 49.05,69.53 R90.2
N$32
  Top 0.61: T9.1 44.77,71.44 | 44.77,71.44 44.77,71.46 44.74,71.44 44.77,71.44 | 44.77,71.44 45.88,71.44 R90.1
N$33  (via drill 0.3)
  Top 0.254: IC6.6 69.14,61.35 68.9,61.59 64.93,61.59 v63.34,60.01 | v64.45,58.26 65.67,58.26 C58.1
  Top 0.406: 65.83,58.1 C58.1
  Bottom 0.254: v63.34,60.01 63.34,59.37 v64.45,58.26
N$34
  Top 0.61: T9.3 40.64,72.43 R89.2 R87.1
N$35
  Top 0.61: C64.1 58.42,73.66 LCD1.21
N$36
  Bottom 0.406: R54.1 77.47,73.66 78.32,72.81 C46.1 C48.1
N$37
  Top 0.61: C64.2 55.88,73.66 LCD1.22
N$38
  Bottom 0.305: IC3.7 71.3,69.4 71.75,69.85 71.75,73.76 R58.2
  Bottom 0.406: R57.1 R58.2
N$39
  Top 0.61: C65.1 50.8,73.85 LCD1.24
N$40
  Top 0.254: IC5.1 IC5.2 66.91,35.16 R65.1
  Top 0.406: 66.04,33.97 R65.1
N$41  (via drill 0.3)
  Top 0.305: T2.3 52.03,11.47 56.2,7.3 60.64,7.3 63.5,10.16 77.79,10.16 v78.11,10.48 | v77.47,19.68 R39.2
  Top 0.406: R35.1 47.94,11.43 48.26,11.43 49.11,11.43 T2.3
  Bottom 0.305: v78.11,10.48 78.42,10.79 78.42,18.73 v77.47,19.68
N$42  (via drill 0.3)
  Top 0.305: v68.9,43.5 v66.2,43.5
  Bottom 0.305: 69.69,43.5 v68.9,43.5 | v66.2,43.5 66.2,45.67 IC4.1
  Bottom 0.406: C41.2 69.69,43.5
N$43  (via drill 0.3)
  Top 0.406: v69.11,22.96 77.37,22.96 R39.1
  Bottom 0.406: v69.11,22.96 69.79,22.96 69.85,23.02 69.9,22.89 T1.1
N$44  (via drill 0.3)
  Top 0.254: IC5.6 69.15,39.21 63.66,39.21 v63.66,37.94 | v64.61,36.2 65.67,36.2 C59.1
  Top 0.406: 65.72,35.88 C59.1
  Bottom 0.254: v63.66,37.94 63.66,37.15 v64.61,36.2
N$45
  Bottom 0.305: 70.64,45.67 IC4.10 70.96,45.67 70.64,45.24
  Bottom 0.61: 76.02,44.45 D5.C 76.52,44.45 | C41.1 71.49,43.55 71.6,43.66 | L4.1 82.23,47.31
  Bottom 1.016: 70.64,45.24 71.6,45.24 71.6,44.45 | 71.6,44.45 76.02,44.45 | 71.6,43.66 71.6,44.45 | 82.23,47.31 79.38,44.45 76.52,44.45
N$46
  Top 0.406: T5.1 82.61,57.85 83.5,58.74 83.82,58.74 R79.1
N$47
  Bottom 0.406: R34.1 R36.2 72.06,23.91 T1.3
N$48
  Top 0.305: R76.1 R78.2
  Top 0.406: R78.2 78.9,58.74 80.07,58.74 T5.3
N$49  (via drill 0.3)
  Top 0.406: v89.22,34.61 R81.1 R85.2 | v94.3,34.61 95.35,34.61 T8.3 | R85.2
  Bottom 0.406: v89.22,34.61 v94.3,34.61
N$50
  Top 0.406: R85.1 83.38,36.51 T7.1
N$51
  Top 0.406: R82.1 R84.2 80.17,36.51 80.21,36.55 T7.3
N$52
  Top 0.305: 16.18,13.79 LED5.A 16.08,13.65 | R17.1
  Top 0.406: R17.1 16.08,13.65
N$53
  Top 0.406: R77.1 95.25,61.28 96.53,59.99 T6.2
N$54
  Top 0.406: R83.1 95.3,39.05 T8.2
N$55
  Bottom 0.305: IC4.4 64.75,47.17 63.98,47.94 C39.1
N$56
  Bottom 0.305: IC4.8 C43.1
  Bottom 0.406: 72.87,46.99 72.87,49.21 | 72.87,49.21 72.87,49.69 73.34,50.16 73.34,51.38 R53.1 | C45.1 | C45.1 72.87,49.21
  Bottom 0.61: C43.1 72.87,46.99 | 72.87,46.99
N$57
  Bottom 0.406: C49.1 C47.1 78.26,49.05 78.26,50.64 77.47,51.44 R55.1
N$58
  Bottom 0.305: IC4.7 71.46,47.17 71.75,47.47 71.75,51.22 R61.2
  Bottom 0.406: R61.2 R60.1
N$59
  Top 0.406: R63.1 102.87,40.64 LED9.A
N$61
  Bottom 0.406: R50.1 R48.2
N$62
  Bottom 0.305: IC3.2 63.5,68.4 D6.C
N$63
  Bottom 0.406: R49.2 R51.1
N$64
  Bottom 0.305: IC3.5 65.36,69.9 65.09,70.17 65.09,73.76 R50.2
N$65
  Bottom 0.406: R52.2 R54.2
N$66
  Bottom 0.406: R56.1 R57.2
N$67
  Bottom 0.305: IC4.5 65.36,47.67 65.09,47.94 65.09,51.22 R51.2
N$68
  Top 0.406: LED6.A 23.7,4.86 | 23.7,4.86 | 23.7,4.86 23.7,6.98 R18.1
N$69
  Bottom 0.406: R60.2 R59.1
N$70
  Bottom 0.406: R55.2 R53.2
N$71
  Top 0.305: 23.8,11.73 R19.1
  Top 0.406: LED7.A 23.8,11.73
N$72
  Bottom 0.254: IC4.2 64.2,46.17 D7.C
N$73
  Top 0.406: LED8.A R62.1
PA0_SMBUS_SDA  (via drill 0.3)
  Top 0.305: IC2.1 25.14,62.17 23.5,63.82 15.88,63.82 v13.65,61.59 | X1.2 6.99,42.55 6.99,47.62 12.38,53.02 v12.38,56.83
  Top 0.406: R3.2 10.16,41.91 X1.2
  Bottom 0.305: v12.38,56.83 12.38,60.33 v13.65,61.59
PA1_SMBUS_SCL  (via drill 0.3)
  Top 0.305: IC2.2 24.69,61.67 23.18,63.18 16.83,63.18 v14.13,60.48 | v13.34,58.1 13.34,52.07 14.61,50.8 R2.2
  Top 0.406: X1.3 R2.2
  Bottom 0.305: v14.13,60.48 13.34,59.69 v13.34,58.1
PA2_POWER_LED
  Top 0.305: IC2.3 24.24,61.17 22.86,62.55 17.46,62.55 14.61,59.69 10.79,59.69 9.84,58.73 R1.1
PA3_CAM1_ENABLE  (via drill 0.3)
  Top 0.305: IC2.4 23.79,60.67 v22.86,61.59 | v43.18,67.31 45.4,65.09 48.58,65.09 49.21,64.45 v59.37,64.45
  Bottom 0.305: IC3.3 61.28,68.9 61.28,67.31 | 61.44,67.47 R46.2 61.43,67.31 60.33,67.31 59.37,66.36 v59.37,64.45 | v22.86,61.59 25.4,61.59 27.3,63.5 34.29,63.5 38.1,67.31 v43.18,67.31
  Bottom 0.406: 61.44,67.47 61.28,67.31 61.28,68.9
PA4_CAM2_ENABLE  (via drill 0.3)
  Top 0.305: IC2.5 23.02,60.17 v22.7,60.48 | v59.69,46.67 59.69,50.8 v57.15,53.34 | v42.23,66.36 44.13,64.45 47.94,64.45 48.9,63.5 v57.15,63.5
  Bottom 0.305: IC4.3 63.34,46.67 62.87,46.67 62.23,46.67 61.75,46.67 | 61.75,46.67 R47.2 | v22.7,60.48 25.56,60.48 27.62,62.55 34.61,62.55 38.42,66.36 v42.23,66.36 | 61.75,46.67 61.28,46.67 v59.69,46.67 | v57.15,63.5 v57.15,53.34
PA5_LOG_FLUSH_LED
  Top 0.305: IC2.6 22.25,59.67 21.27,60.64 16.83,60.64 15.24,59.05 12.06,59.05 11.11,58.1 11.11,54.93 R4.1
PA6_BATT_OUTPUT_POWER  (via drill 0.3)
  Top 0.305: R68.2 v104.46,49.53 | v97,49.53 v97,56.2 | v95.25,62.87 95.25,78.42 94.3,79.38 27.94,79.38 26.67,78.11 26.67,74.93 25.56,73.82 v25.56,63.5 | IC2.7 21.48,59.17 v20.95,59.69
  Bottom 0.305: v104.46,49.53 v97,49.53 | v97,56.2 97,61.12 v95.25,62.87 | v20.95,59.69 20.95,61.59 22.86,63.5 v25.56,63.5
PA8_PUSHBUTTON_UP  (via drill 0.3)
  Top 0.305: IC2.17 26.73,53.4 25.4,52.07 25.4,46.67 24.77,46.04 v24.77,33.97 22.86,32.07 22.86,23.97 21.75,22.86 21.59,22.64 LED3.C | 66.83,24.92 66.83,24.77 65.88,23.81 50.48,23.81 46.67,27.62 46.67,33.34 45.72,34.29 v34.29,34.29
  Top 0.406: 79.69,24.77 79.55,24.91 S1.2 S1.1 66.85,24.91 66.83,24.92 | 79.69,24.77 79.69,24.79 | 79.69,24.77 R20.1 C26.2
  Bottom 0.305: v34.29,34.29 33.97,33.97 v24.77,33.97
PA9_PUSHBUTTON_RIGHT  (via drill 0.3)
  Top 0.305: IC2.18 27.23,52.95 26.04,51.75 26.04,46.35 25.4,45.72 25.4,41.59 28.26,38.73 28.26,16.19 29.37,15.24 | v76.83,16.03 76.83,14.92 75.88,13.97 46.35,13.97 46.04,14.29 33.34,14.29 32.38,15.24 29.37,15.24 | 29.37,15.24 29.37,13.8 LED4.C
  Top 0.406: S2.2 S2.1 79.72,16.03 v76.83,16.03
  Bottom 0.305: 77.09,13.12 76.83,13.18 v76.83,16.03
  Bottom 0.406: R21.1 77.09,8.67 76.83,8.73 76.83,12.9 C27.2 77.09,13.12
PA10_PUSHBUTTON_LEFT  (via drill 0.3)
  Top 0.305: IC2.19 27.73,52.49 26.67,51.44 26.67,46.04 26.04,45.4 26.04,41.91 29.21,38.73 v29.21,17.14 32.38,17.14 33.34,16.19 54.29,16.19 54.29,15.88 | LED5.C 14.13,13.75 14.13,13.65 v13.02,13.65
  Top 0.406: S3.2 S3.1 54.34,15.92 54.29,15.88 | C28.2 62.55,16.28 S3.2 | S3.2 64.75,16.02 R22.1
  Bottom 0.305: v13.02,13.65 16.51,17.14 v29.21,17.14
PB7_LFXTAL_P
  Top 0.305: IC2.15 23.41,55.17 21.61,53.36 Q2.2
  Top 0.406: Q2.2 21.61,50.38 C17.2
PB8_LFXTAL_N
  Top 0.305: 24.13,51.45 Q2.1 24.11,52.25 24.13,52.39 24.13,53.98 24.82,54.67 IC2.16
  Top 0.406: Q2.1 24.11,50.22 C12.2
PB11_POWER_GOOD  (via drill 0.3)
  Top 0.254: R10.2 105.41,21.59 105.09,21.91 102.55,21.91 102.35,22.11 IC1.8
  Top 0.305: IC2.21 28.73,51.59 27.94,50.8 27.94,41.27 28.57,40.64 48.58,40.64 49.53,39.69 49.53,27.94 52.07,25.4 63.82,25.4 65.72,27.3 75.88,27.3 77.79,29.21 97.16,29.21 v98.11,30.16 | R10.2 107.63,20.64 108.27,21.27 108.27,28.26 v106.36,30.16
  Bottom 0.305: v106.36,30.16 v98.11,30.16
PB13_HFXTAL_P
  Top 0.305: IC2.24 30.23,49.91 29.53,49.21 29.53,47.63 Q3.2 C18.2
PB14_HFXTAL_N
  Top 0.305: IC2.25 30.73,48.65 32.07,47.31 33.34,47.31 33.34,46.68 Q3.1 C13.2
PC0_RFID_RX  (via drill 0.3)
  Top 0.305: v24.13,66.67 24.13,77.47 26.67,80.01 99.69,80.01 115.73,63.82 115.73,28.57 X3.1 | IC2.9 19.93,58.17 v19.68,58.42
  Bottom 0.305: v19.68,58.42 19.37,58.74 19.37,61.91 v24.13,66.67
PC1_RFID_TX  (via drill 0.3)
  Top 0.305: IC2.10 19.57,57.67 v19.21,57.31 | v21.59,66.67 21.59,77.47 24.77,80.64 100.33,80.64 116.52,64.45 116.52,24.77 X3.2
  Bottom 0.305: v19.21,57.31 18.1,58.42 18.1,63.18 v21.59,66.67
PC2_SD_SDO  (via drill 0.3)
  Top 0.305: IC2.11 20.34,57.17 18.41,55.24 v18.41,41.27 | v30.8,36.83 45.72,36.83 47.47,35.08 v47.47,31.43
  Bottom 0.305: v18.41,41.27 22.86,36.83 v30.8,36.83 | v47.47,31.43 47.47,30.8 47.31,30.64 47.31,30.14 SD1.2
PC3_SD_SDI  (via drill 0.3)
  Top 0.305: IC2.12 21.11,56.67 19.05,54.61 19.05,41.91 21.91,39.05 v21.91,34.92 | v55.88,40.01 R41.1 | v33.34,35.24 v45.72,35.24
  Bottom 0.305: v33.34,35.24 33.02,34.92 v21.91,34.92 | SD1.7 59.85,30.48 59.85,30.64 59.69,30.48 59.69,30.8 59.53,30.96 56.83,33.66 56.83,39.05 v55.88,40.01 47.94,40.01 45.72,37.78 v45.72,35.24
PC4_SD_CLK  (via drill 0.3)
  Top 0.305: IC2.13 21.88,56.17 19.68,53.98 19.68,42.55 v23.18,39.05 | v47.31,37.78 v29.84,37.78
  Bottom 0.305: SD1.5 54.93,30 54.93,35.88 53.02,37.78 v47.31,37.78 | v29.84,37.78 24.45,37.78 v23.18,39.05
PC5_SD_CS  (via drill 0.3)
  Top 0.305: IC2.14 22.65,55.67 20.32,53.34 20.32,43.81 v23.18,40.96 | v43.5,38.73 v30.8,38.73
  Bottom 0.305: SD1.1 44.9,30.98 43.5,32.38 v43.5,38.73 | v30.8,38.73 25.4,38.73 v23.18,40.96
PC6_SD_CD  (via drill 0.3)
  Top 0.305: IC2.37 36.99,56.67 38.42,55.24 41.59,55.24 v41.91,54.93 | v66.99,18.89 66.2,18.89 63.82,21.27 54.29,21.27 R40.2 53.32,21.25 52.86,20.8 52.86,18.57 52.39,18.1 33.97,18.1 33.02,19.05 33.02,29.21 v36.83,33.02
  Bottom 0.305: v41.91,54.93 41.91,49.53 40.01,47.62 40.01,36.2 v36.83,33.02
  Bottom 0.406: SD1.CDS 65.16,18.64 65.41,18.89 v66.99,18.89
PC7_SD_WP  (via drill 0.3)
  Top 0.305: IC2.38 37.45,57.17 38.73,55.88 42.55,55.88 43.81,54.61 48.26,54.61 51.44,51.44 51.44,31.75 52.7,30.48 74.93,30.48 v75.25,30.16 | v82.87,9.53 v66.52,9.53 63.66,6.67 55.56,6.67 54.61,7.62 R42.1
  Bottom 0.305: SD1.WPS 65.41,9.53 | v82.87,9.53 82.87,22.54 v75.25,30.16
  Bottom 0.406: 65.41,9.53 v66.52,9.53
PC8_MEASURE_ON_UA1  (via drill 0.3)
  Top 0.254: IC6.3 v69.15,56.2 69.15,54.93 | 71.92,59.06 72.08,58.9 71.6,58.9 v70.64,57.63
  Top 0.305: 69.15,54.93 75.25,54.93 75.88,55.56 75.88,56.52 75.88,56.2 75.88,55.88 75.89,56.67 | 69.23,54.94 69.15,54.93 | 69.15,54.93 62.23,54.93 57.15,60.01 44.61,60.01 43.97,60.64 38.58,60.64 36.6,58.67 IC2.41
  Top 0.406: 71.92,59.06 R67.1 | 75.89,56.67 R76.2
  Bottom 0.254: v70.64,57.63 69.53,56.2 v69.15,56.2
PC9_MEASURE_ON_UA2  (via drill 0.3)
  Top 0.254: IC5.3 69.14,33.09 v69.22,33.02 | 71.12,36.04 v70.64,35.56
  Top 0.305: 71.91,36.83 71.12,36.04 | R82.2 76.2,33.66 75.56,33.02 v69.22,33.02 | v57.15,46.67 57.15,51.75 v55.56,53.34 | IC2.42 36.31,59.17 38.42,61.28 44.29,61.28 44.93,60.64 v55.56,60.64
  Top 0.406: R66.1 71.91,36.83
  Bottom 0.254: v70.64,35.56 70.64,35.48
  Bottom 0.305: v55.56,53.34 v55.56,60.64 | v57.15,46.67 59.37,44.45 59.37,34.29 61.28,32.38 68.58,32.38 v69.22,33.02 69.14,33.09 69.14,33.97 70.64,35.48
PC10_SD_POWER  (via drill 0.3)
  Top 0.305: v68.26,23.81 67.63,23.18 49.85,23.18 46.04,26.99 46.04,33.02 45.4,33.66 40.64,33.66 v40.01,33.02 | IC2.43 36.02,59.67 38.26,61.91 44.77,61.91 v45.09,61.59
  Bottom 0.305: 75.56,26.66 75.56,27.62 75.25,27.94 72.39,27.94 v68.26,23.81 | v45.09,61.59 45.4,61.28 45.4,50.48 40.96,46.04 40.96,33.97 v40.01,33.02
  Bottom 0.406: R34.2 75.56,26.66
PC12_SD_PULLUP  (via drill 0.3)
  Top 0.305: IC2.45 36.22,60.67 38.1,62.55 45.4,62.55 v46.35,61.59 | R40.1 54.29,18.41 53.02,17.14 33.66,17.14 32.07,18.73 v32.07,32.07
  Bottom 0.305: v46.35,61.59 46.35,48.9 41.91,44.45 41.91,32.7 41.27,32.07 v32.07,32.07
PC13_PUSHBUTTON_DOWN  (via drill 0.3)
  Top 0.305: S4.1 66.89,6.99 65.41,6.99 64.45,6.03 51.12,6.03 47.31,2.22 28.89,2.22 v27.3,3.81 27.3,38.42 v26.04,39.69 | v21.59,3.81 21.59,4.75 LED6.C | IC2.46 35.93,61.17 37.94,63.18 46.35,63.18 v47.31,62.23 | v42.86,39.69 v29.84,39.69
  Top 0.406: S4.1 v72.07,7.13 S4.2
  Bottom 0.305: v27.3,3.81 v21.59,3.81 | v47.31,62.23 47.31,47.31 42.86,42.86 v42.86,39.69 | v29.84,39.69 v26.04,39.69
  Bottom 0.406: C29.2 72.01,5.5 72.07,5.56 v72.07,7.13 72.07,8.56 R23.1
PC14_PUSHBUTTON_SET  (via drill 0.3)
  Top 0.305: v21.75,16.19 21.75,13.65 21.7,13.65 LED7.C | v48.26,62.87 47.31,63.82 37.78,63.82 35.63,61.67 IC2.47 | v44.77,36.04 32.23,36.04 30.48,34.29 v30.48,18.41 | v30.48,16.19 32.38,16.19 33.34,15.24 46.99,15.24 47.62,14.61 v67.03,14.61 S5.1 S5.2
  Bottom 0.305: v21.75,16.19 v30.48,16.19 v30.48,18.41 | v48.26,62.87 48.26,41.59 44.77,38.1 v44.77,36.04 | R24.1 71.86,13.75 C30.2 71.91,15.97 71.91,17.14 67.03,17.14 v67.03,14.61
PC15_BOOTER  (via drill 0.3)
  Top 0.305: IC2.48 35.34,62.17 37.78,64.61 v38.73,64.61 | v49.85,62.23 R6.1
  Bottom 0.305: v38.73,64.61 39.37,64.61 40.32,65.56 46.51,65.56 v49.85,62.23
PD0_ADC_IA1_IN  (via drill 0.3)
  Top 0.254: IC6.4 69.94,57.38 v70.64,56.67
  Top 0.305: IC2.28 32.23,51.75 32.86,51.12 32.86,50.48 33.34,50.01 v36.83,50.01 | v52.7,51.44 48.9,55.24 44.13,55.24 v43.18,56.2
  Top 0.406: R72.1 72.07,56.67 71.12,56.67 v70.64,56.67
  Bottom 0.305: v70.64,56.67 70.64,54.77 61.12,54.77 57.78,51.44 v52.7,51.44 | v43.18,56.2 41.27,56.2 36.83,51.75 v36.83,50.01
PD1_DCF77_ENABLE  (via drill 0.3)
  Top 0.305: IC2.29 32.73,52.2 v33.18,51.75 | X4.2 5.08,26.67 5.08,47.31 v9.53,51.75
  Bottom 0.305: v33.18,51.75 v9.53,51.75
PD2_DCF77_SIGNAL  (via drill 0.3)
  Top 0.305: IC2.30 33.23,52.81 34.29,51.75 v34.29,51.12 | X4.1 3.81,24.13 3.81,47.62 v6.99,50.8
  Bottom 0.305: v34.29,51.12 32.7,50.01 28.57,50.01 27.3,50.8 v6.99,50.8
PD3_ADC_IA2_IN  (via drill 0.3)
  Top 0.254: IC5.4 69.67,35.16 69.67,34.61 v70.64,34.61
  Top 0.305: IC2.31 33.73,53.27 34.92,52.07 48.26,52.07 50.16,50.16 50.16,28.57 52.7,26.04 63.66,26.04 65.88,28.26 v70.64,28.26
  Top 0.406: R73.1 70.8,34.61 v70.64,34.61
  Bottom 0.406: v70.64,34.61 v70.64,28.26
PD4_LEUART_TX  (via drill 0.3)
  Top 0.305: IC2.32 34.23,53.72 35.24,52.7 v39.37,52.7 | R26.1 81.28,6.99 79.69,5.4 51.75,5.4 47.94,1.59 28.26,1.59 26.35,3.49 v26.35,35.88
  Bottom 0.305: v26.35,35.88 32.07,35.88 38.1,41.91 38.1,51.44 v39.37,52.7
PD5_LEUART_RX  (via drill 0.3)
  Top 0.305: R25.1 52.39,4.76 48.58,0.95 27.62,0.95 25.4,3.17 v25.4,33.02 | IC2.33 34.93,54.29 35.88,53.34 v40.32,53.34
  Bottom 0.305: v25.4,33.02 34.92,33.02 39.05,37.15 39.05,49.21 40.32,50.48 v40.32,53.34
PD6_ADC_UA1_IN  (via drill 0.3)
  Top 0.305: R80.2 92.71,55.88 91.12,54.29 61.91,54.29 57.15,59.05 47.31,59.05 v44.45,56.2 | IC2.34 35.63,55.17 36.83,53.98 40.64,53.98 41.59,53.02 v43.18,53.02
  Top 0.406: T6.1 94.53,59.05 C61.1 | C61.1 | C61.1 92.71,59.05 R80.2
  Bottom 0.305: v43.18,53.02 44.45,54.29 v44.45,56.2
PD7_ADC_UA2_IN  (via drill 0.3)
  Top 0.305: C62.1 94.46,36.83 | 94.46,36.83 | 94.46,36.83 v94.46,36.04 | v95.89,30.16 77.15,30.16 76.2,29.21 73.66,29.21 73.03,29.84 51.75,29.84 50.8,30.8 50.8,50.8 47.62,53.98 41.59,53.98 40.96,54.61 37.15,54.61 36.09,55.67 IC2.35
  Top 0.406: R86.2 92.71,36.73 C62.1 92.63,36.8 T8.1
  Bottom 0.305: v94.46,36.04 95.89,34.61 v95.89,30.16
PD8_LCD_POWER  (via drill 0.3)
  Top 0.305: IC2.36 36.54,56.17 v36.83,55.88 | v40.64,64.77 40.64,67.94 40.01,68.58 38.73,68.58 38.1,69.22 R87.2
  Bottom 0.305: v36.83,55.88 36.83,60.96 v40.64,64.77
PE8_LCD_D0  (via drill 0.3)
  Top 0.305: IC2.56 30.73,71.37 v32.38,73.03
  Bottom 0.305: v32.38,73.03 24.77,73.03 22.86,74.93 LCD1.35
PE9_LCD_D1  (via drill 0.3)
  Top 0.305: IC2.57 30.23,72.46 v31.59,73.82
  Bottom 0.305: v31.59,73.82 26.51,73.82 25.4,74.93 LCD1.34
PE10_LCD_D2  (via drill 0.3)
  Top 0.305: IC2.58 29.73,73.55 v30.8,74.61
  Bottom 0.305: v30.8,74.61 28.26,74.61 27.94,74.93 LCD1.33
PE11_LCD_D3
  Top 0.305: IC2.59 29.23,74.31 30.48,75.56 LCD1.32
PE12_LCD_D4  (via drill 0.3)
  Top 0.305: IC2.60 28.73,67.63 v28.42,67.94
  Bottom 0.305: v28.42,67.94 33.02,67.94 35.88,70.8 35.88,73.34 LCD1.31
PE13_LCD_D5  (via drill 0.3)
  Top 0.305: IC2.61 28.23,66.7 v27.94,66.99
  Bottom 0.305: v27.94,66.99 33.02,66.99 36.83,70.8 36.83,74.93 LCD1.30
PE14_LCD_D6  (via drill 0.3)
  Top 0.305: IC2.62 27.73,65.77 v27.3,66.2
  Bottom 0.305: v27.3,66.2 33.18,66.2 38.1,71.12 LCD1.29
PE15_LCD_D7
  Top 0.305: IC2.63 27.23,64.22 26.35,65.09 26.35,72.39 29.21,75.25 29.21,77.15 29.53,77.47 39.37,77.47 LCD1.28
PF0_DBG_SWCLK  (via drill 0.3)
  Top 0.305: IC2.49 34.29,62.87 34.29,62.88 34.92,63.51 35.24,63.82 35.24,71.91 v35.08,72.07
  Bottom 0.305: X5.4 9.13,68.34 8.26,69.22 8.26,71.75 9.21,72.71 15.56,72.71 19.05,69.22 32.23,69.22 v35.08,72.07
PF1_DBG_SWDIO  (via drill 0.3)
  Top 0.305: IC2.50 33.73,63.26 34.61,64.14 v34.61,70.64
  Bottom 0.305: v34.61,70.64 32.54,68.58 17.78,68.58 14.61,71.75 10.48,71.75 9.77,71.05 X5.2
PF2_DBG_SWO  (via drill 0.3)
  Top 0.305: IC2.51 33.23,63.55 33.97,64.29 v33.97,72.07
  Bottom 0.305: X5.6 8.59,66.34 7.3,67.63 7.3,72.07 8.89,73.66 15.88,73.66 19.68,69.85 31.75,69.85 v33.97,72.07
PF3_LCD_ENABLE  (via drill 0.3)
  Top 0.305: IC2.52 32.73,63.84 33.34,64.45 33.34,71.75 v32.86,72.23
  Bottom 0.305: LCD1.36 20.32,74.93 23.02,72.23 v32.86,72.23
PF4_LCD_RW  (via drill 0.3)
  Top 0.305: IC2.53 32.23,64.14 32.7,64.61 32.7,70.8 v32.07,71.44
  Bottom 0.305: LCD1.37 17.78,74.93 21.27,71.44 v32.07,71.44
PF5_LCD_RS  (via drill 0.3)
  Top 0.305: IC2.54 31.73,64.43 32.07,64.77 32.07,70.01 v31.43,70.64
  Bottom 0.305: LCD1.39 12.7,75.25 13.34,74.61 16.19,74.61 20.16,70.64 v31.43,70.64
RXD_HOST
  Top 0.406: R26.2 86.36,6.99 91.12,11.75 95.25,11.75 96.52,10.48 96.52,8.56 J1.P$3
SD_+3.3V  (via drill 0.3)
  Top 0.305: T2.1 51.12,10.44 R42.2
  Top 0.406: R42.2 51.18,7.62 51.18,10.41 51.12,10.48 51.3,10.48 T2.1
  Top 0.61: R38.2 43.18,19.37 | 49.21,19.53 C32.1 49.21,19.37 | 51.44,19.53 C33.1 51.44,19.37 49.21,19.37 | v52.39,32.7 v52.39,45.09 | v55.88,45.09 R41.2 R37.2 | R42.2 48.9,7.62 46.99,5.71 41.91,5.71 40.01,7.62 v34.29,7.62 | 49.21,19.37 46.35,19.37 | R43.2 46.35,19.37 | 46.35,19.37 43.18,19.37 | 43.18,19.37 v34.29,19.37 34.29,25.4 41.59,32.7 v45.09,32.7
  Bottom 0.305: SD1.4 52.4,30.15 52.39,30.16
  Bottom 0.61: 52.39,30.16 v52.39,32.7 | v52.39,45.09 v55.88,45.09 | v34.29,19.37 v34.29,7.62 | SD1.4 52.4,32.38 v52.39,32.7 | v52.39,32.7 v45.09,32.7
TXD_HOST
  Top 0.406: R25.2 90.49,4.76 93.98,8.26 J1.P$2 93.98,10
UA1  (via drill 0.3, 0.6)
  Top 0.406: 64.77,70.17 v66.99,72.39 64.45,69.85 64.45,64.45 65.41,63.5 75.25,63.5 v78.11,60.64 | v78.11,60.64 | v78.11,60.64 | R77.2 90.81,60.96 90.17,60.32 88.45,58.61 87.76,58.61 | 87.76,58.61 v86.04,58.61 | R74.2 87.76,58.61 | R62.2 100.33,44.45 LSP1.MP
  Top 1.016: v95.57,45.4 v95.57,55.24 | F2.P$1 LSP1.MP
  Bottom 0.305: R56.2 67.25,73.82 67.25,73.76 66.99,73.5
  Bottom 0.406: 66.99,73.5 v66.99,72.39
  Bottom 0.61: C52.1 | C50.1 80.64,58.58 80.49,58.58 | 80.49,58.58 | 80.49,58.58 79.38,58.58 78.9,58.58 | 78.9,58.58 | 78.9,58.58 78.11,59.37 v78.11,60.64
  Bottom 0.813: C50.1 C52.1
  Bottom 1.016: L3.2 91.76,70.17 91.76,58.58 | C52.1 v86.04,58.61 C54.1 88.14,58.58 91.76,58.58 | 91.76,58.58 94.46,58.58 95.57,57.47 v95.57,55.24 | LSP1.MP v95.57,45.4
UA1_OUT
  Top 1.016: F2.P$2 106.91,45.24 X2.5
UA2  (via drill 0.3)
  Top 0.406: v66.99,50.16 64.45,47.62 64.45,42.23 65.41,41.27 75.25,41.27 v78.11,38.42 | v78.11,38.42 | R81.2 87.82,36.51 C55.1 87.34,36.38 87.31,36.35 | 87.31,36.35 v86.04,36.35 | R83.2 90.81,38.58 88.58,36.35 87.31,36.35 | R63.2 100.33,38.73 LSP2.MP
  Top 1.016: F3.P$1 LSP2.MP
  Bottom 0.305: v66.99,50.16
  Bottom 0.406: R59.2 v66.99,50.16
  Bottom 0.61: 78.11,37.15 v78.11,38.42 78.11,37.15 | 80.64,36.35 78.9,36.35 78.11,37.15
  Bottom 1.016: L4.2 91.65,47.78 91.76,47.78 91.76,37.78 | 91.76,37.78 90.33,36.35 88.08,36.35 C55.1 87.95,36.51 87.95,36.35 v86.04,36.35 84.27,36.35 C53.1 84.11,36.38 84.14,36.35 80.78,36.35 C51.1 80.64,36.51 80.64,36.35 | 91.76,37.78 LSP2.MP
UA2_OUT
  Top 0.813: 112.71,37.78 X2.7
  Top 1.016: F3.P$2 112.71,37.78
VDCF  (via drill 0.6)
  Top 0.61: D1.1 102.89,13.81 102.87,13.81 | 103.03,10.46 103.03,10.32 102.89,10.32
  Top 0.813: D1.1 102.89,10.32 102.89,10.13 | 103.03,10.46 C6.+
  Top 1.016: 102.87,12.06 102.87,13.81 102.87,13.97 C7.1 113.35,13.81 118.9,22.38 v119.38,60.96
  Bottom 1.016: v119.38,60.96 99.69,80.64 10.16,80.64 1.27,71.75 1.27,38.1 X4.4
VMCU  (via drill 0.3)
  Top 0.305: v31.43,65.09 31.23,64.89 IC2.55 | IC2.8 20.73,58.67 20.64,58.74 20,59.37 18.41,59.37 16.83,57.78 16.55,57.78 C20.2 | IC2.26 31.23,49.41 32.38,48.26 34.61,48.26 35.08,47.78 C16.2 | IC2.39 37.9,57.67 39.05,56.52 41.27,56.52 41.59,56.83 C25.2 | R6.2 v55.56,62.23 | v51.44,65.25 51.44,67.58
  Top 0.406: C22.2 36.99,67.15 37.15,66.99 | 51.44,67.58 T10.2 | C24.2 14.76,57.78 | 15.72,57.78 C20.2 | 35.6,47.47 37.47,47.47 C15.2 | 35.6,47.47 C16.2 | 35.6,47.47 35.56,47.47 v35.56,48.42 | 43.18,57.47 C14.2 | 21.75,20.32 21.75,20.37 R15.2 | v16.51,53.34
  Top 0.61: T10.2 R88.2 45.41,67.63 v44.45,68.58 | 37.15,66.99 v37.15,68.58 | v16.51,59.05 C20.2 16.19,57.78 15.72,57.78 14.76,57.78 | 92.08,22.54 R13.1 92.08,27.3 91.44,27.94 81.28,27.94 | D3.1 92.05,22.54 92.08,22.54 | 92.08,22.54 C9.2 | R20.2 81.28,26.51 | 81.28,26.51 81.28,27.94 | 81.28,26.51 v81.28,17.78 76.99,17.78 64.77,17.78 R22.2 | v81.28,8.73 v73.82,8.73 v67.94,8.73 | R18.2 21.8,9.21 | 21.8,9.21 R19.2 21.8,9.26 v21.75,9.21 | 19.68,9.21 15.08,9.21 14.13,10.16 14.13,11.43 R17.2 | 19.68,9.21 v21.75,9.21 | v21.75,9.21 21.8,9.21 | v29.21,9.21 29.21,11.32 R16.2 | 81.28,27.94 78.11,27.94 76.52,26.35 66.04,26.35 64.29,24.61 51.59,24.61 48.58,27.62 48.58,39.05 47.94,39.69 v44.45,39.69 | v44.29,57.47 43.18,57.47 | C14.2 C25.2 | 44.45,42.55 v36.83,42.55 | v44.45,41.59 44.45,42.55 | 44.45,42.55 L2.1 | 19.68,20.32 19.68,9.21 | v24.45,65.09 v16.51,65.09 | v16.51,53.34 R2.1 R3.1 16.51,40.64 15.56,39.69 14.29,39.69 13.65,39.05 13.65,25.08 | 13.65,25.08 13.65,21.91 15.24,20.32 19.68,20.32 | 19.68,20.32 21.75,20.32 | R27.2 13.65,25.08
  Bottom 0.305: v55.56,62.23 55.56,64.29 54.77,65.09 51.59,65.09 v51.44,65.25
  Bottom 0.406: R23.2 70.06,8.78 70.17,8.89 | 75.25,8.73 75.25,8.78 R21.2
  Bottom 0.61: v24.45,65.09 v31.43,65.09 33.66,65.09 v37.15,68.58 v44.45,68.58 | 35.56,53.34 v16.51,53.34 v16.51,59.05 v16.51,65.09 16.51,66.67 12.85,70.34 X5.1 | v81.28,17.78 v81.28,8.73 | v73.82,8.73 75.08,8.73 R21.2 | R23.2 70,8.73 v67.94,8.73 67.94,13.34 68.36,13.75 R24.2 | v21.75,9.21 v29.21,9.21 | v44.45,39.69 v44.45,41.59 | 35.56,53.34 v35.56,48.42 36.83,47.15 v36.83,42.55 | 35.56,53.34 36.83,53.34 40.96,57.47 v44.29,57.47
VSD
  Top 0.406: T2.2 46.84,9.54 R35.2
  Top 0.61: C5.+ 36.51,9.53 C8.1 | D2.1 43.84,9.39 C8.1 | R35.2 45.08,9.53 C8.1

## Text on the board
Top: PL27022018 | BS
Bottom: PL27022018 | LS
tPlace: TAMDL_V2
tNames: SWDIO | SWCLK | SWO | MCU_RESET | GND | BATT / INP | BATT / OUT | GND | SMBUS / SCL | UA1_ / OUT | GND | SMBUS / SDA | RESET | UA2_OUT | SMBUS / GND | GND | DCF / VDCF | RFID_RX | DCF / GND | RFID_TX | DCF / ENABLE | UP | GND | DCF / SIGNAL | LEFT | SET | RIGHT | Down
Document: SMBUS_GND | SMBUS_SDA | SMBUS_SCL | BATT_GND | BATT_IN | BATT_OUT | GND | UA1_OUT | GND | UA2_OUT | GND | PC0_RX | PC1_TX | DCF77_SIG | DCF77_EN | DCF_GND | DCF_VDCF